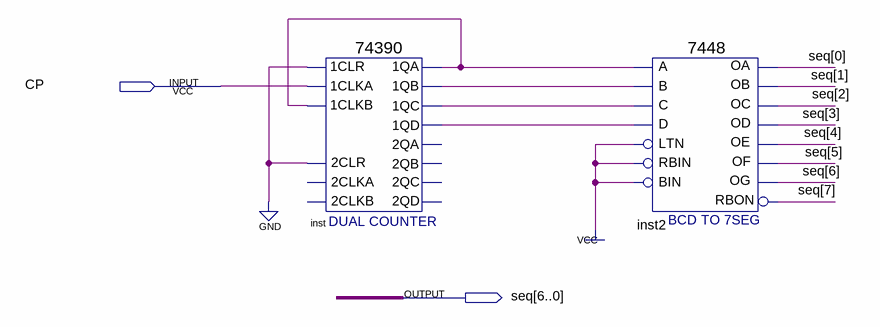
[diagram p0: schematic sheet]
// Quartus schematic lab1.bdf as structural Verilog: 2 symbols, 2 pins
module lab1 (
  input  CP,
  output [7:0] seq
);

  wire inst_1qa, inst_1qb, inst_1qc, inst_1qd;

  \74390  inst (
    .\2CLR (1'b0), .\1CLR (1'b0), .\1CLKA (CP), .\1CLKB (inst_1qa), .\1QA (inst_1qa), .\1QB (inst_1qb),
    .\1QC (inst_1qc), .\1QD (inst_1qd));  // open: 2CLKA, 2CLKB, 2QA, 2QB, 2QC, 2QD
  \7448  inst2 (
    .A(inst_1qa), .C(inst_1qc), .D(inst_1qd), .B(inst_1qb), .RBIN(1'b1), .BIN(1'b1), .LTN(1'b1), .OC(seq[2]),
    .OE(seq[4]), .OD(seq[3]), .OF(seq[5]), .OG(seq[6]), .OB(seq[1]), .OA(seq[0]), .RBON(seq[7]));
endmodule
